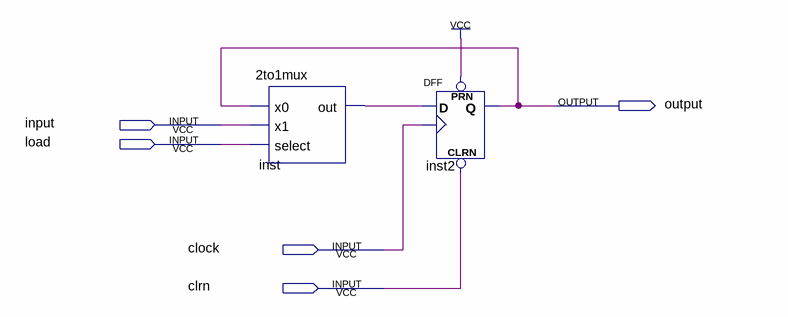
[diagram p0: schematic sheet]
// Quartus schematic register.bdf as structural Verilog: 2 symbols, 5 pins
module register (
  input  \input ,
  input  load,
  input  clock,
  input  clrn,
  output \output 
);

  wire inst_out;

  \2to1mux  inst (.x0(\output ), .x1(\input ), .select(load), .out(inst_out));
  DFF inst2 (.CLRN(clrn), .CLK(clock), .D(inst_out), .PRN(1'b1), .Q(\output ));
endmodule
